# EAGLE schematic temp_RH_loggers_V2_(~recovered) (EAGLE 9.7.0)
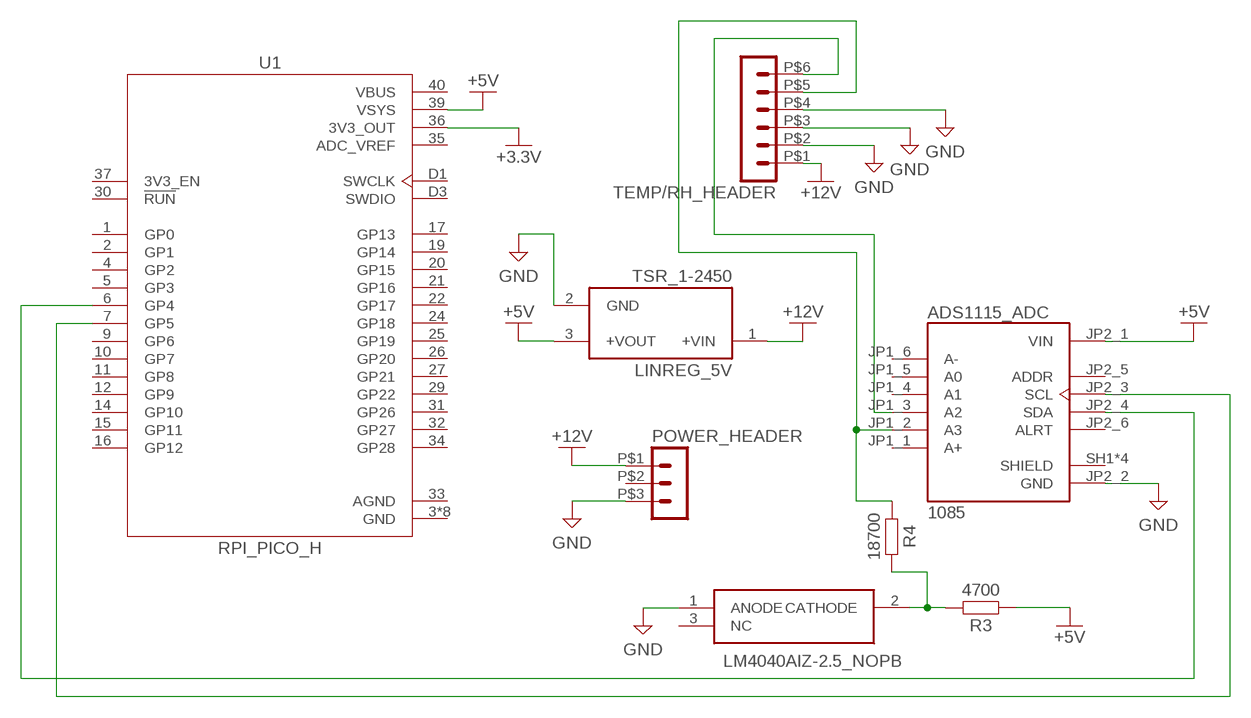
[diagram p0: schematic, sheet 1]

## Parts
ADS1115_ADC  1085  [MODULE_1085]
IC1  LM4040AIZ-2.5_NOPB  [LP0003A]
LINREG_5V  TSR_1-2450  [CONV_TSR_1-2450]
POWER_HEADER  HEADER_POS3_43650-0315  [43650-0315]
R3  4700  R_AXIAL-11.7MM-PITCH  [RESAD1176W63L850D250B]
R4  18700  R_AXIAL-11.7MM-PITCH  [RESAD1176W63L850D250B]
TEMP/RH_HEADER  HEADER_POS6_43045-0600  [43045-0600]
U1  RPI_PICO_H  [PI_PICO_H]

## Nets
+3.3V: U1.36(3V3_OUT)
+5V: ADS1115_ADC.JP2_1(VIN) LINREG_5V.3(+VOUT) R3.1 U1.39(VSYS)
+12V: LINREG_5V.1(+VIN) POWER_HEADER.P$1 TEMP/RH_HEADER.P$1
GND: ADS1115_ADC.JP2_2(GND) IC1.1(ANODE) LINREG_5V.2(GND) POWER_HEADER.P$3 TEMP/RH_HEADER.P$2 TEMP/RH_HEADER.P$3 TEMP/RH_HEADER.P$4
N$1: IC1.2(CATHODE) R3.2 R4.2
N$2: ADS1115_ADC.JP1_2(A3) R4.1 TEMP/RH_HEADER.P$5
N$3: ADS1115_ADC.JP1_3(A2) TEMP/RH_HEADER.P$6
N$4: ADS1115_ADC.JP2_4(SDA) U1.6(GP4)
N$5: ADS1115_ADC.JP2_3(SCL) U1.7(GP5)
Unconnected: ADS1115_ADC.JP1_1(A+) ADS1115_ADC.JP1_4(A1) ADS1115_ADC.JP1_5(A0) ADS1115_ADC.JP1_6(A-) ADS1115_ADC.JP2_5(ADDR) ADS1115_ADC.JP2_6(ALRT) ADS1115_ADC.SH1(SHIELD) ADS1115_ADC.SH2(SHIELD) ADS1115_ADC.SH3(SHIELD) ADS1115_ADC.SH4(SHIELD) IC1.3(NC) POWER_HEADER.P$2 U1.1(GP0) U1.2(GP1) U1.4(GP2) U1.5(GP3) U1.9(GP6) U1.10(GP7) U1.11(GP8) U1.12(GP9) U1.14(GP10) U1.15(GP11) U1.16(GP12) U1.17(GP13) U1.19(GP14) U1.20(GP15) U1.21(GP16) U1.22(GP17) U1.24(GP18) U1.25(GP19) U1.26(GP20) U1.27(GP21) U1.29(GP22) U1.30(!RUN) U1.31(GP26) U1.32(GP27) U1.34(GP28) U1.37(3V3_EN) U1.D1(SWCLK) U1.D3(SWDIO)

## Power pins joined to a net without a drawn wire
ADC_VREF: U1.35(ADC_VREF)
AGND: U1.33(AGND)
GND: U1.3(GND) U1.8(GND) U1.13(GND) U1.18(GND) U1.23(GND) U1.28(GND) U1.38(GND) U1.D2(GND)
VBUS: U1.40(VBUS)

## Library data of the parts
ADS1115_ADC = 1085:1085: Check availability <https://pricing.snapeda.com/parts/1085/Adafruit%20Industries/view-part?ref=eda>; AVAILABILITY: In Stock; CHECK_PRICES: https://www.snapeda.com/parts/1085/Adafruit+Industries/view-part/?ref=eda; DESCRIPTION: ADS1115 series 16 Bit 860 Samples per Second Analog to Digital Converter (ADC) Evaluation Board; MF: Adafruit Industries; MP: 1085; PACKAGE: NON STANDARD-16 Adafruit; PRICE: None; PURCHASE-URL: https://www.snapeda.com/api/url_track_click_mouser/?unipart_id=378491&manufacturer=Adafruit Industries&part_name=1085&search_term=None; SNAPEDA_LINK: https://www.snapeda.com/parts/1085/Adafruit+Industries/view-part/?ref=snap
IC1 = LM4040AIZ-2.5_NOPB:LM4040AIZ-2.5_NOPB: 100-ppm/C precision micropower shunt voltage reference Source: Datasheet <http://www.ti.com/lit/gpn/lm4040-n>; DESCRIPTION: 100-ppm/C precision micropower shunt voltage reference; HEIGHT: mm; MANUFACTURER_NAME: Texas Instruments; MANUFACTURER_PART_NUMBER: LM4040AIZ-2.5/NOPB; MOUSER_PART_NUMBER: 926-LM4040AIZ25NOPB; MOUSER_PRICE-STOCK: https://www.mouser.co.uk/ProductDetail/Texas-Instruments/LM4040AIZ-2.5-NOPB?qs=QbsRYf82W3Ggji8pDqIALQ%3D%3D
LINREG_5V = TSR_1-2450:TSR_1-2450: Check availability <https://pricing.snapeda.com/parts/TSR%201-2450/Traco%20Power/view-part?ref=eda>; AVAILABILITY: In Stock; CHECK_PRICES: https://www.snapeda.com/parts/TSR%201-2450/Traco+Power/view-part/?ref=eda; DESCRIPTION: 1 Amp POL switching regulator, wide input range, pos.-pos. circuit, LM78 compatible, SIP-3; MF: Traco Power; MP: TSR 1-2450; PACKAGE: SIP-3 Traco Power; PRICE: None; PURCHASE-URL: https://www.snapeda.com/api/url_track_click_mouser/?unipart_id=45147&manufacturer=Traco Power&part_name=TSR 1-2450&search_term=None; SNAPEDA_LINK: https://www.snapeda.com/parts/TSR%201-2450/Traco+Power/view-part/?ref=snap
POWER_HEADER = con-molex-micro-fit-3_0:HEADER_POS3_?: Molex - Micro-Fit 3.0 Series connector, 3.00mm (0.118") pitch header, 3 positions.
R3 R4 = Resistor:R: Resistor Fixed - Generic; CATEGORY: Resistors; DESCRIPTION: Axial Resistor 11.76 mm pitch 8.5 mm body length 2.5 mm body diameter; PACKAGE_SIZE: AXIAL; PACKAGE_TYPE: THT
TEMP/RH_HEADER = con-molex-micro-fit-3_0:HEADER_POS6_?: Molex - Micro-Fit 3.0 Series connector, 3.00mm (0.118") pitch header, 6 positions.
U1 = Development_Boards:RPI_PICO: Raspberry Pi Pico & Pico 2; CATEGORY_L1: Developement Boards; CATEGORY_L2: Evaluation Boards; DATASHEET: https://pip-assets.raspberrypi.com/categories/610-raspberry-pi-pico/documents/RP-008307-DS-1-pico-datasheet.pdf?disposition=inline; DESCRIPTION: RP2040 Raspberry Pi Pico - ARM® Cortex®-M0+ MCU 32-Bit Embedded Evaluation Board; MANUFACTURER: Raspberry Pi; MPN: SC0917; OPERATING_TEMPERATURE: -20°C ~ 85°C; PACKAGE: Through Hole; PART_STATUS: Active; ROHS: Compliant; SERIES: RP2040